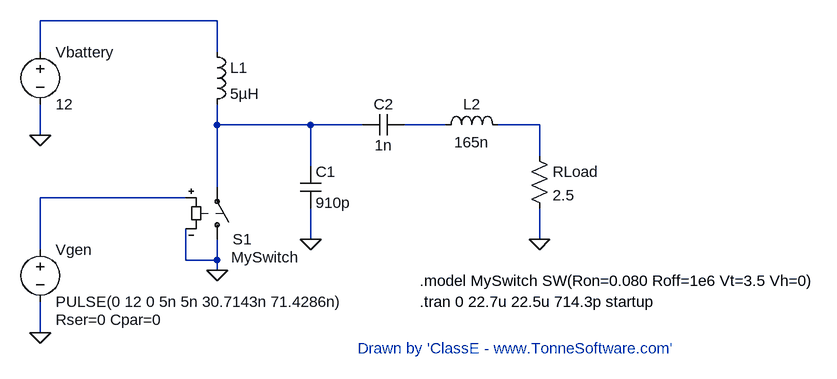
[diagram p0: schematic classe-plain.asc]
classe-plain.asc, the LTspice schematic file:
Version 4
SHEET 1 1296 248
WIRE 272 -272 0 -272
WIRE 0 -224 0 -272
WIRE 272 -224 272 -272
WIRE 272 -112 272 -144
WIRE 416 -112 272 -112
WIRE 496 -112 416 -112
WIRE 624 -112 560 -112
WIRE 768 -112 704 -112
WIRE 0 -96 0 -144
WIRE 768 -64 768 -112
WIRE 416 -48 416 -112
WIRE 272 -16 272 -112
WIRE 224 0 0 0
WIRE 416 64 416 16
WIRE 768 64 768 16
WIRE 0 80 0 0
WIRE 224 96 224 48
WIRE 272 96 272 64
WIRE 272 96 224 96
WIRE 272 112 272 96
WIRE 0 208 0 160
FLAG 0 208 0
FLAG 272 112 0
FLAG 0 -96 0
FLAG 416 64 0
FLAG 768 64 0
SYMBOL voltage 0 -240 R0
WINDOW 123 24 132 Left 2
SYMATTR InstName Vbattery
SYMATTR Value 12
SYMBOL voltage 0 64 R0
WINDOW 123 24 132 Left 2
WINDOW 39 24 124 Left 2
SYMATTR InstName Vgen
SYMATTR Value PULSE(0 12 0 5n 5n 30.7143n 71.4286n)
SYMATTR SpiceLine Rser=0 Cpar=0
SYMBOL ind 256 -240 R0
SYMATTR InstName L1
SYMATTR Value 5µH
SYMBOL cap 400 -48 R0
SYMATTR InstName C1
SYMATTR Value 910p
SYMBOL cap 560 -128 R90
WINDOW 0 0 32 VBottom 2
WINDOW 3 32 32 VTop 2
SYMATTR InstName C2
SYMATTR Value 1n
SYMBOL ind 608 -96 R270
WINDOW 0 32 56 VTop 2
WINDOW 3 5 56 VBottom 2
SYMATTR InstName L2
SYMATTR Value 165n
SYMBOL res 752 -80 R0
SYMATTR InstName RLoad
SYMATTR Value 2.5
SYMBOL sw 272 80 M180
WINDOW 3 22 -12 Left 2
SYMATTR InstName S1
SYMATTR Value MySwitch
TEXT 584 160 Left 2 !.tran 0 22.7u 22.5u 714.3p startup
TEXT 488 232 Left 2 ;Drawn by 'ClassE - www.TonneSoftware.com'
TEXT 584 128 Left 2 !.model MySwitch SW(Ron=0.080 Roff=1e6 Vt=3.5 Vh=0)

The netlist it stands for:
* classe-plain.asc
Vbattery N001 0 12
Vgen N005 0 PULSE(0 12 0 5n 5n 30.7143n 71.4286n) Rser=0 Cpar=0
L1 N001 N002 5µH
C1 N002 0 910p
C2 N003 N002 1n
L2 N003 N004 165n
RLoad N004 0 2.5
S1 0 N002 N005 0 MySwitch
.tran 0 22.7u 22.5u 714.3p startup
* Drawn by 'ClassE - www.TonneSoftware.com'
.model MySwitch SW(Ron=0.080 Roff=1e6 Vt=3.5 Vh=0)
.backanno
.end